# EAGLE schematic micromouse_schematic (EAGLE 8.6.3)
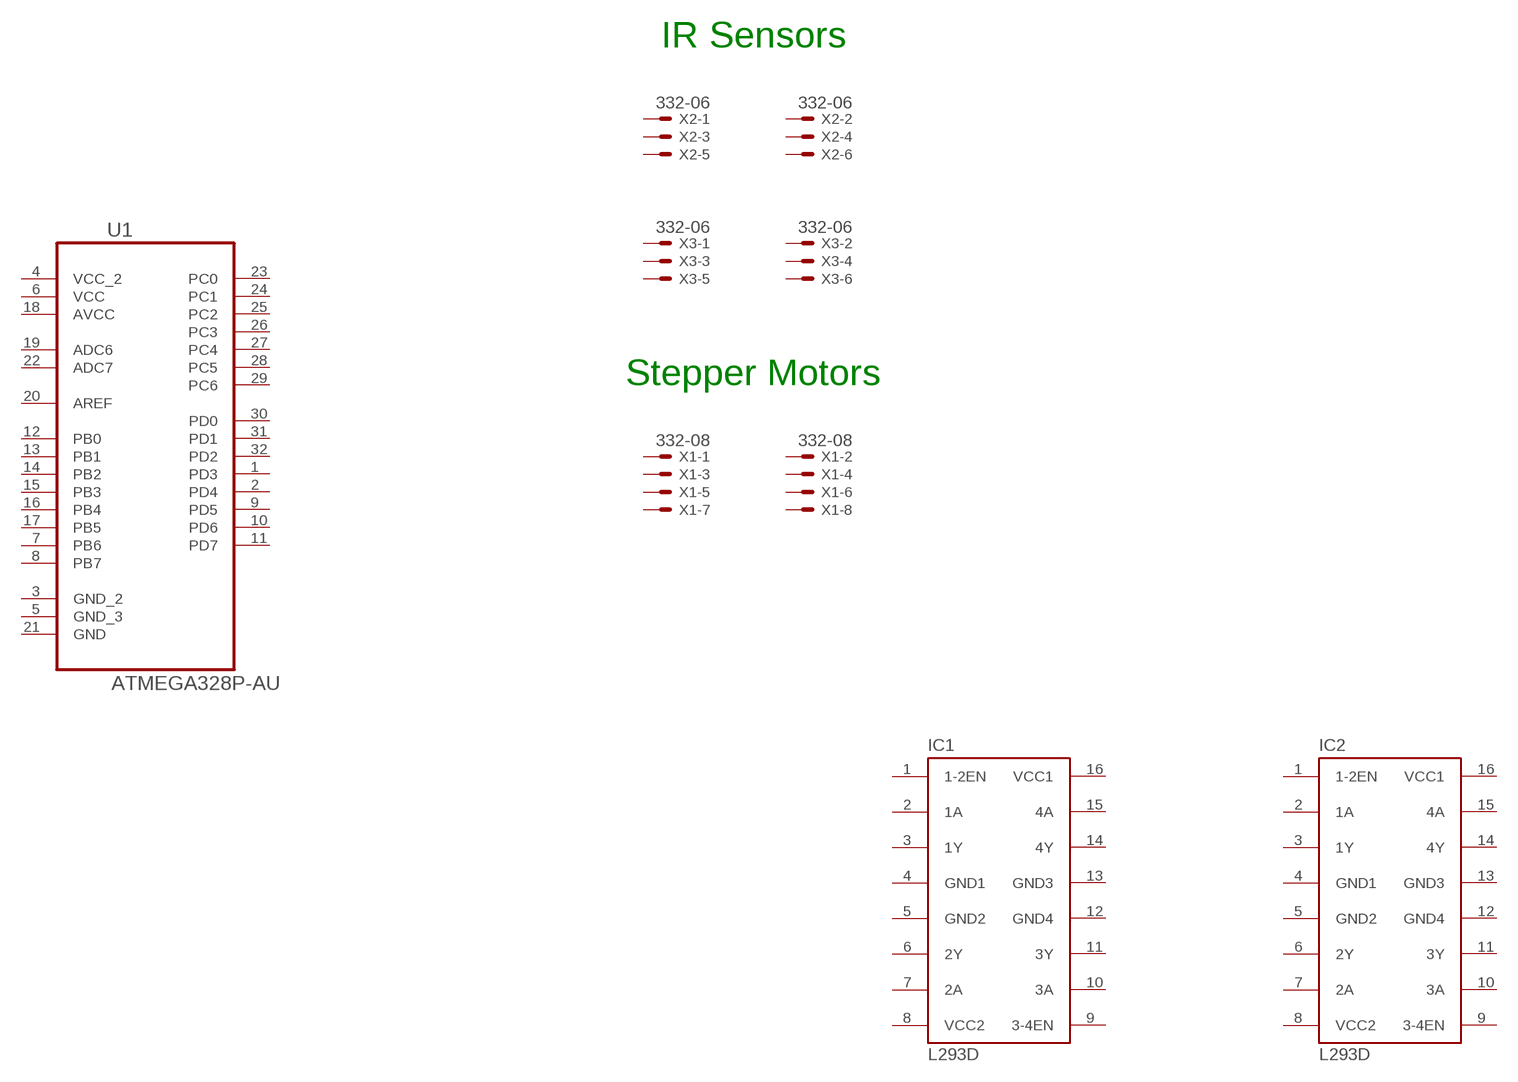
[diagram p0: schematic, sheet 1]

## Parts
IC1  L293D  [DIL16]
IC2  L293D  [DIL16]
U1  ATMEGA328P-AU  [QFP80P900X900X120-32N]
X1  332-08  [332-08]
X2  332-06  [332-06]
X3  332-06  [332-06]
Unconnected: IC1.1(1-2EN) IC1.2(1A) IC1.3(1Y) IC1.6(2Y) IC1.7(2A) IC1.9(3-4EN) IC1.10(3A) IC1.11(3Y) IC1.14(4Y) IC1.15(4A) IC2.1(1-2EN) IC2.2(1A) IC2.3(1Y) IC2.6(2Y) IC2.7(2A) IC2.9(3-4EN) IC2.10(3A) IC2.11(3Y) IC2.14(4Y) IC2.15(4A) U1.1(PD3) U1.2(PD4) U1.3(GND_2) U1.5(GND_3) U1.7(PB6) U1.8(PB7) U1.9(PD5) U1.10(PD6) U1.11(PD7) U1.12(PB0) U1.13(PB1) U1.14(PB2) U1.15(PB3) U1.16(PB4) U1.17(PB5) U1.19(ADC6) U1.20(AREF) U1.21(GND) U1.22(ADC7) U1.23(PC0) U1.24(PC1) U1.25(PC2) U1.26(PC3) U1.27(PC4) U1.28(PC5) U1.29(PC6) U1.30(PD0) U1.31(PD1) U1.32(PD2) X1.1 X1.2 X1.3 X1.4 X1.5 X1.6 X1.7 X1.8 X2.1 X2.2 X2.3 X2.4 X2.5 X2.6 X3.1 X3.2 X3.3 X3.4 X3.5 X3.6

## Notes on the sheet
- IR Sensors
- Stepper Motors

## Power pins joined to a net without a drawn wire
AVCC: U1.18(AVCC)
GND1: IC1.4(GND1) IC2.4(GND1)
GND2: IC1.5(GND2) IC2.5(GND2)
GND3: IC1.13(GND3) IC2.13(GND3)
GND4: IC1.12(GND4) IC2.12(GND4)
VCC: U1.6(VCC)
VCC1: IC1.16(VCC1) IC2.16(VCC1)
VCC2: IC1.8(VCC2) IC2.8(VCC2)
VCC_2: U1.4(VCC_2)

## Library data of the parts
IC1 IC2 = st-microelectronics:L293D: PUSH-PULL 4 CHANNEL DRIVER; MPN: L293D; OC_FARNELL: 9589619; OC_NEWARK: 56P8249
U1 = Atmel_By_element14_Batch_1-00:ATMEGA328P-AU: 8-bit Microcontroller with In-System Programmable Flash; MPN: ATMEGA328P-AU; OC_FARNELL: 1715486; OC_NEWARK: 14R4631; PACKAGE: TQFP-32; SUPPLIER: Atmel
X1 = con-garry:332-08: 8 Pin - 2mm Dual Row Source: www.mpe-connector.de / garry_shortform_2012.pdf
X2 X3 = con-garry:332-06: 6 Pin - 2mm Dual Row Source: www.mpe-connector.de / garry_shortform_2012.pdf